# EAGLE design CCLoad (EAGLE 7.7.0)
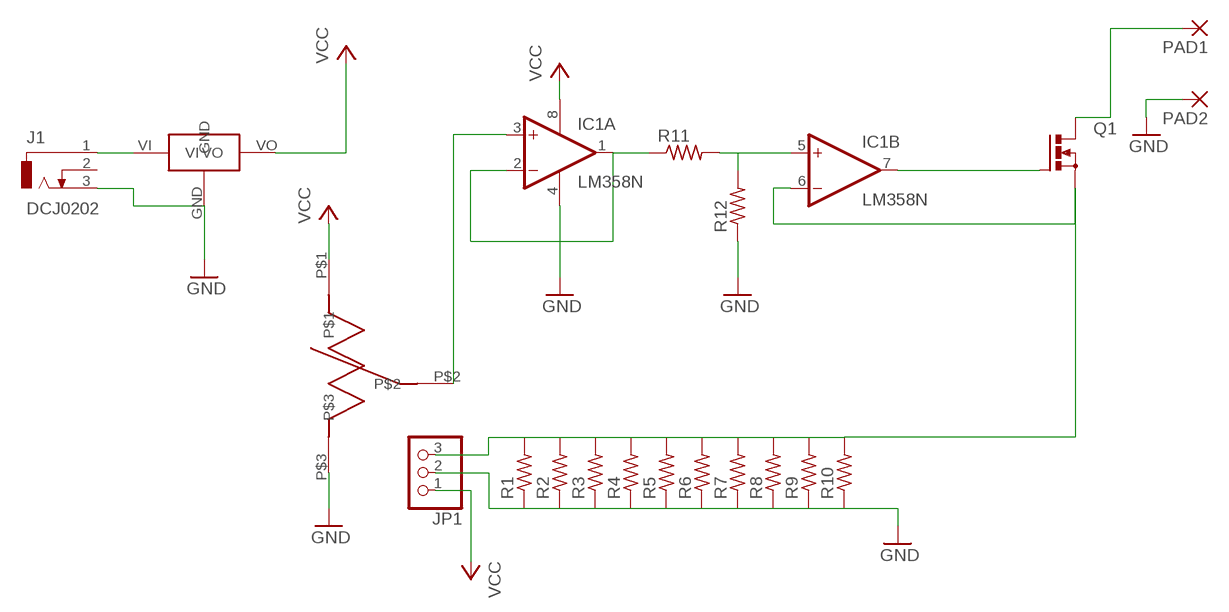
[diagram p0: schematic, sheet 1]

## Parts
IC1  LM358N  [DIL08]
J1  DCJ0202  [DCJ0202]
JP1  PINHD-1X3  [1X03]
PAD1  3,17/1,3  [3,17/1,3]
PAD2  3,17/1,3  [3,17/1,3]
Q1  PMOSFET_NTO220BV  [TO220BV]
R1  R-US_0207/10  [0207/10]
R2  R-US_0207/10  [0207/10]
R3  R-US_0207/10  [0207/10]
R4  R-US_0207/10  [0207/10]
R5  R-US_0207/10  [0207/10]
R6  R-US_0207/10  [0207/10]
R7  R-US_0207/10  [0207/10]
R8  R-US_0207/10  [0207/10]
R9  R-US_0207/10  [0207/10]
R10  R-US_0207/10  [0207/10]
R11  R-US_0207/10  [0207/10]
R12  R-US_0207/10  [0207/10]
U$1  3590  [3590]
U$3  7805-TO220V  [TO220AV]

## Nets
GND: IC1.4(P:V-) J1.3 JP1.2 PAD2.1(P) R1.1 R2.1 R3.1 R4.1 R5.1 R6.1 R7.1 R8.1 R9.1 R10.1 R12.1 U$1.P$3 U$3.GND
N$1: IC1.1(A:OUT) IC1.2(A:-IN) R11.1
N$2: IC1.5(B:+IN) R11.2 R12.2
N$3: IC1.7(B:OUT) Q1.G
N$4: IC1.6(B:-IN) JP1.3 Q1.S R1.2 R2.2 R3.2 R4.2 R5.2 R6.2 R7.2 R8.2 R9.2 R10.2
N$5: PAD1.1(P) Q1.D
N$6: J1.1 U$3.VI
N$7: IC1.3(A:+IN) U$1.P$2
VCC: IC1.8(P:V+) JP1.1 U$1.P$1 U$3.VO
Unconnected: J1.2

## Library data of the parts
IC1 = linear:LM358: OP AMP also LM158; LM258; LM2904 Source: http://cache.national.com/ds/LM/LM158.pdf
J1 = con-jack-jke:DCJ0202: DC POWER JACK Source: DCJ0202.pdf; OC_FARNELL: unknown; OC_NEWARK: unknown
JP1 = pinhead:PINHD-1X3: PIN HEADER
PAD1 PAD2 = wirepad:3,17/1,3: THROUGH-HOLE PAD
Q1 = transistor-power-heatsink:PMOSFET_N: Power MOSFET N-Channel
R1-R12 = rcl:R-US_: RESISTOR, American symbol
U$1 = Bourns3590:3590
U$3 = LM7805:7805-TO220V

## Board
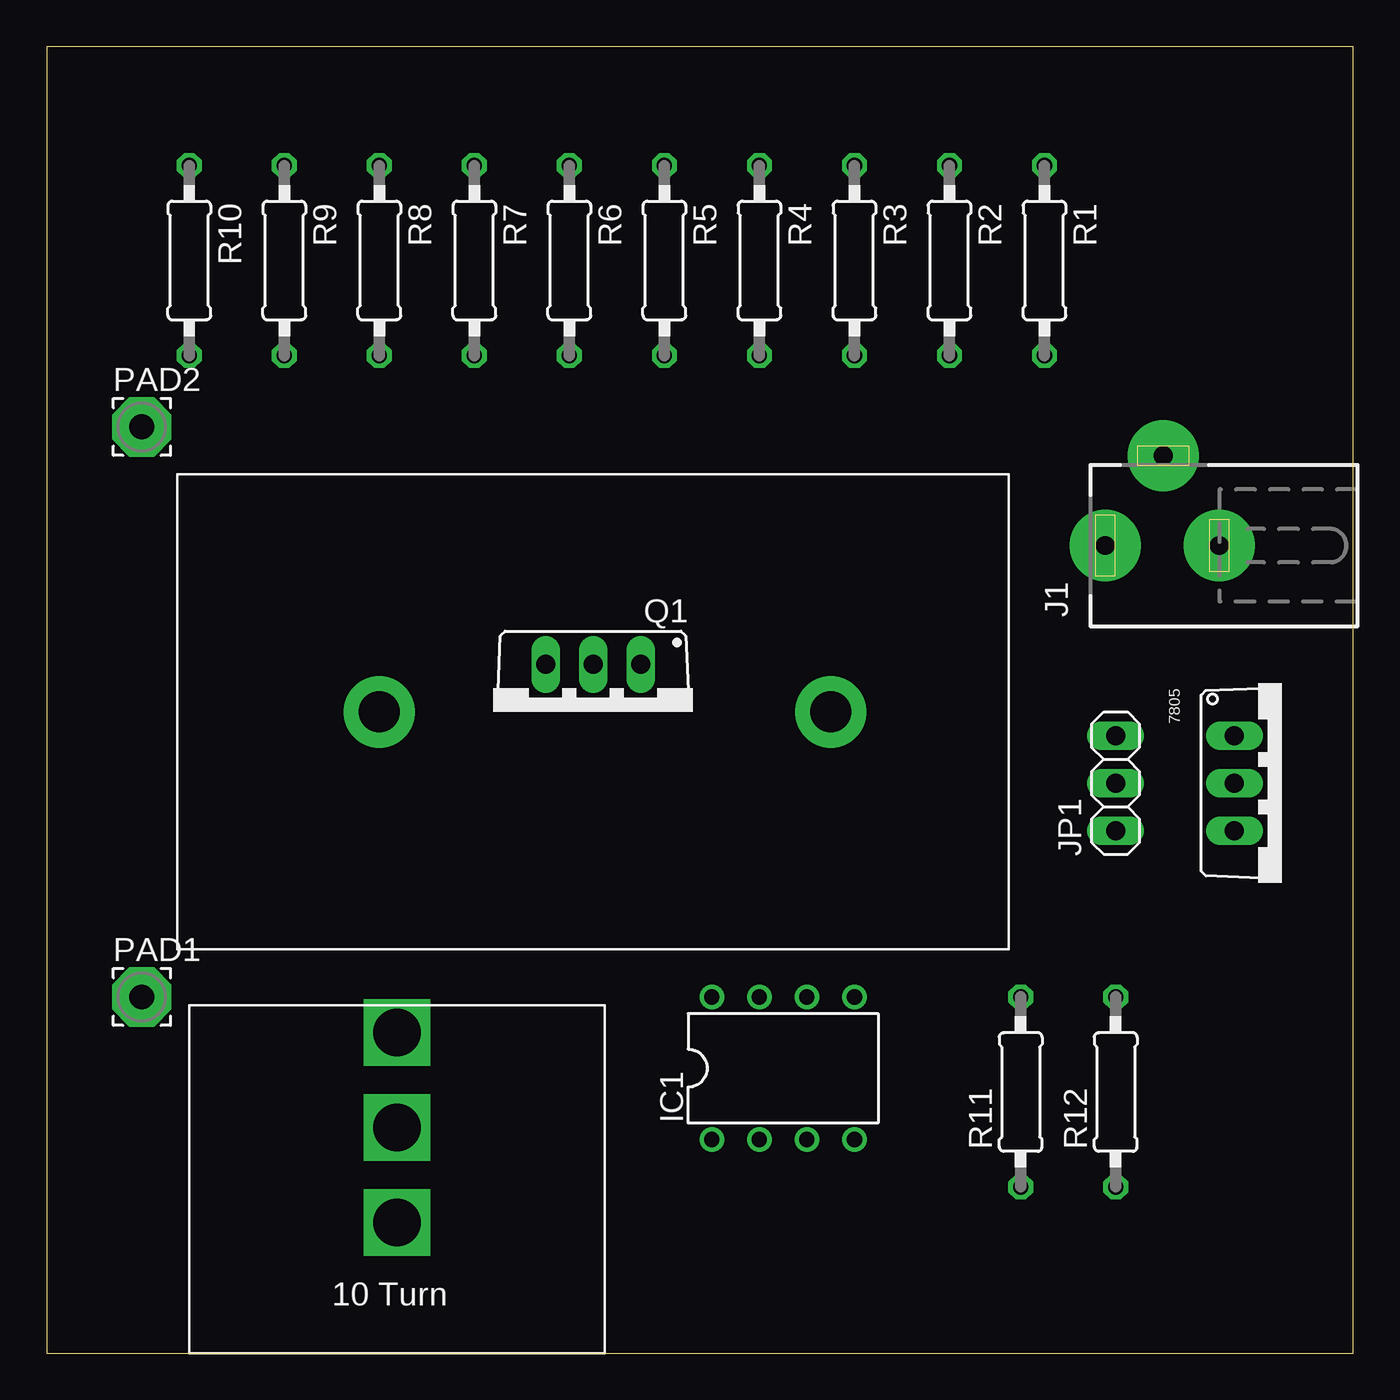
[diagram p1: board, top side]
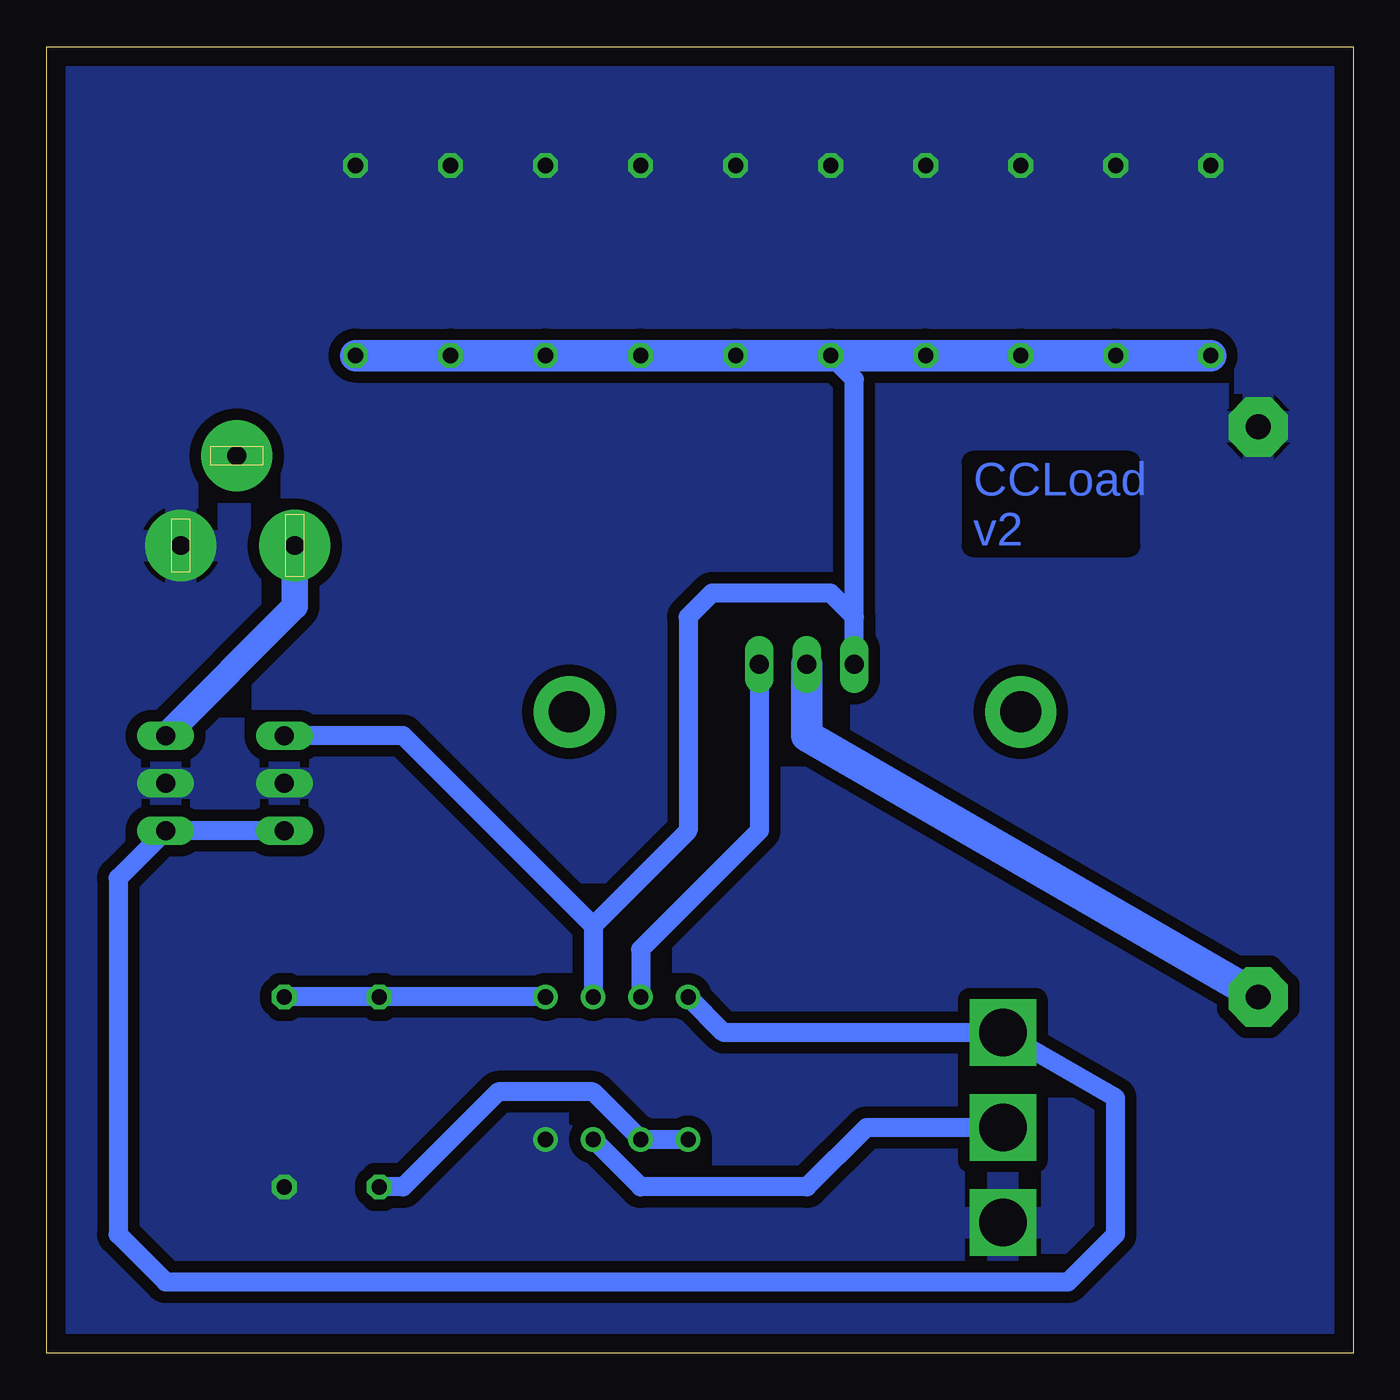
[diagram p2: board, bottom side, seen from below]

Size 69.85 x 69.85 mm. Coordinates in mm from the lower left corner, seen from the top.
Outline: 0,0 69.85,0 69.85,69.85 0,69.85 0,0
Copper layers (1*16): Top 0.035mm / dielectric 1.5mm / Bottom 0.035mm
Design rules "default": minimum track width 10mil, minimum drill 24mil, track to track 8mil, track to pad 8mil, pad to pad 8mil, via to via 8mil, smd to smd 8mil, copper to edge 40mil, drill to drill 8mil, minimum pad ring 10mil, minimum via ring 8mil, stop-mask expansion 4mil, vias tented up to drill 0mil, thermal gap 10mil

### Footprints (pad centres in the part's own frame; a part is rotated, then mirrored left to right if it is on the bottom)
DIL08 = drill 0.813 pad 1.27: 1 -3.81,-3.81; 2 -1.27,-3.81; 3 1.27,-3.81; 4 3.81,-3.81; 5 3.81,3.81; 6 1.27,3.81; 7 -1.27,3.81; 8 -3.81,3.81
DCJ0202 = drill 1 pad 3.81: 1 0,3.1; 2 4.8,0; 3 0,-3
1X03 = drill 1.016 long: 1 -2.54,0; 2 0,0; 3 2.54,0
3,17/1,3 = drill 1.321 pad 3.175 octagon: 1 0,0
TO220BV = drill 1.016 long: D 0,-2.54; G -2.54,-2.54; S 2.54,-2.54 | drill 2.2 pad 3.81: GND 11.43,0; P$2 -12.7,0
0207/10 = drill 0.813 octagon: 1 -5.08,0; 2 5.08,0
3590 = drill 2.54 square: P$1 11.113,17.145; P$2 11.113,12.065; P$3 11.113,6.985
TO220AV = drill 1.016 long: GND 0,-2.54; VI -2.54,-2.54; VO 2.54,-2.54

### Placement (x,y rotation side)
IC1  39.37,15.24 0 top
J1  59.69,43.18 90 top
JP1  57.15,30.48 90 top
PAD1  5.08,19.05 0 top
PAD2  5.08,49.53 0 top
Q1  29.21,34.29 180 top
R1  53.34,58.42 270 top
R2  48.26,58.42 270 top
R3  43.18,58.42 270 top
R4  38.1,58.42 270 top
R5  33.02,58.42 270 top
R6  27.94,58.42 270 top
R7  22.86,58.42 270 top
R8  17.78,58.42 270 top
R9  12.7,58.42 270 top
R10  7.62,58.42 270 top
R11  52.07,13.97 90 top
R12  57.15,13.97 90 top
U$1  7.62,0 0 top
U$3  66.04,30.48 270 top

### Tracks (layer width: path | path; a pad name or v marks a point on that pad's centre or on a via)
GND
  pour Bottom (isolate 0.61): -1.27,71.12 -1.27,-1.27 71.12,-1.27 71.12,71.12
N$1
  Bottom 1.016: IC1.1 IC1.2 40.64,13.97 45.72,13.97 50.8,8.89 R11.1
N$2
  Bottom 1.016: IC1.5 R11.2 R12.2
N$3
  Bottom 1.016: Q1.G 31.75,27.94 38.1,21.59 IC1.7
N$4
  Bottom 1.016: R6.2 26.67,52.07 Q1.S 26.67,39.37 27.94,40.64 34.29,40.64 35.56,39.37 35.56,27.94 40.64,22.86 | 40.64,22.86 IC1.6 | 40.64,22.86 50.8,33.02 JP1.3
  Bottom 1.676: R1.2 R2.2 R3.2 R4.2 R5.2 R6.2 R7.2 R8.2 R9.2 R10.2
N$5
  Bottom 1.676: Q1.D 29.21,33.02 PAD1.1
N$6
  Bottom 1.422: J1.1 56.59,39.93 U$3.VI
N$7
  Bottom 1.016: U$1.P$2 26.04,12.06 29.21,8.89 38.1,8.89 IC1.3
VCC
  Bottom 1.016: IC1.8 33.66,17.14 U$1.P$1 12.7,13.65 12.7,6.35 15.24,3.81 63.5,3.81 66.04,6.35 66.04,25.4 U$3.VO JP1.1

### Text on the board
Bottom: CCLoad / v2